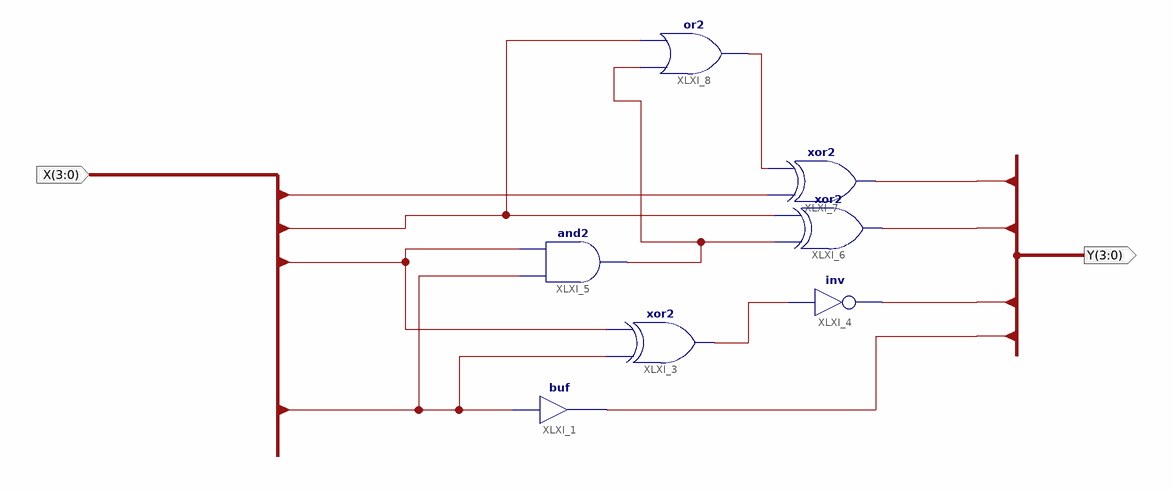
[diagram p0: schematic sheet 1]
// Xilinx ISE schematic Z1.sch (xc9500xl) as structural Verilog: 7 symbols, 2 ports
module Z1 (
  input  [3:0] X,
  output [3:0] Y
);

  wire XLXN_18, XLXN_27, XLXN_29;

  buf XLXI_1 (Y[0], X[0]);
  xor XLXI_3 (XLXN_18, X[0], X[1]);
  not XLXI_4 (Y[1], XLXN_18);
  and XLXI_5 (XLXN_27, X[0], X[1]);
  xor XLXI_6 (Y[2], XLXN_27, X[2]);
  xor XLXI_7 (Y[3], X[3], XLXN_29);
  or XLXI_8 (XLXN_29, XLXN_27, X[2]);
endmodule
